# EAGLE schematic rpglb_badge (EAGLE 9.5.2)

## Sheet 1 of 2
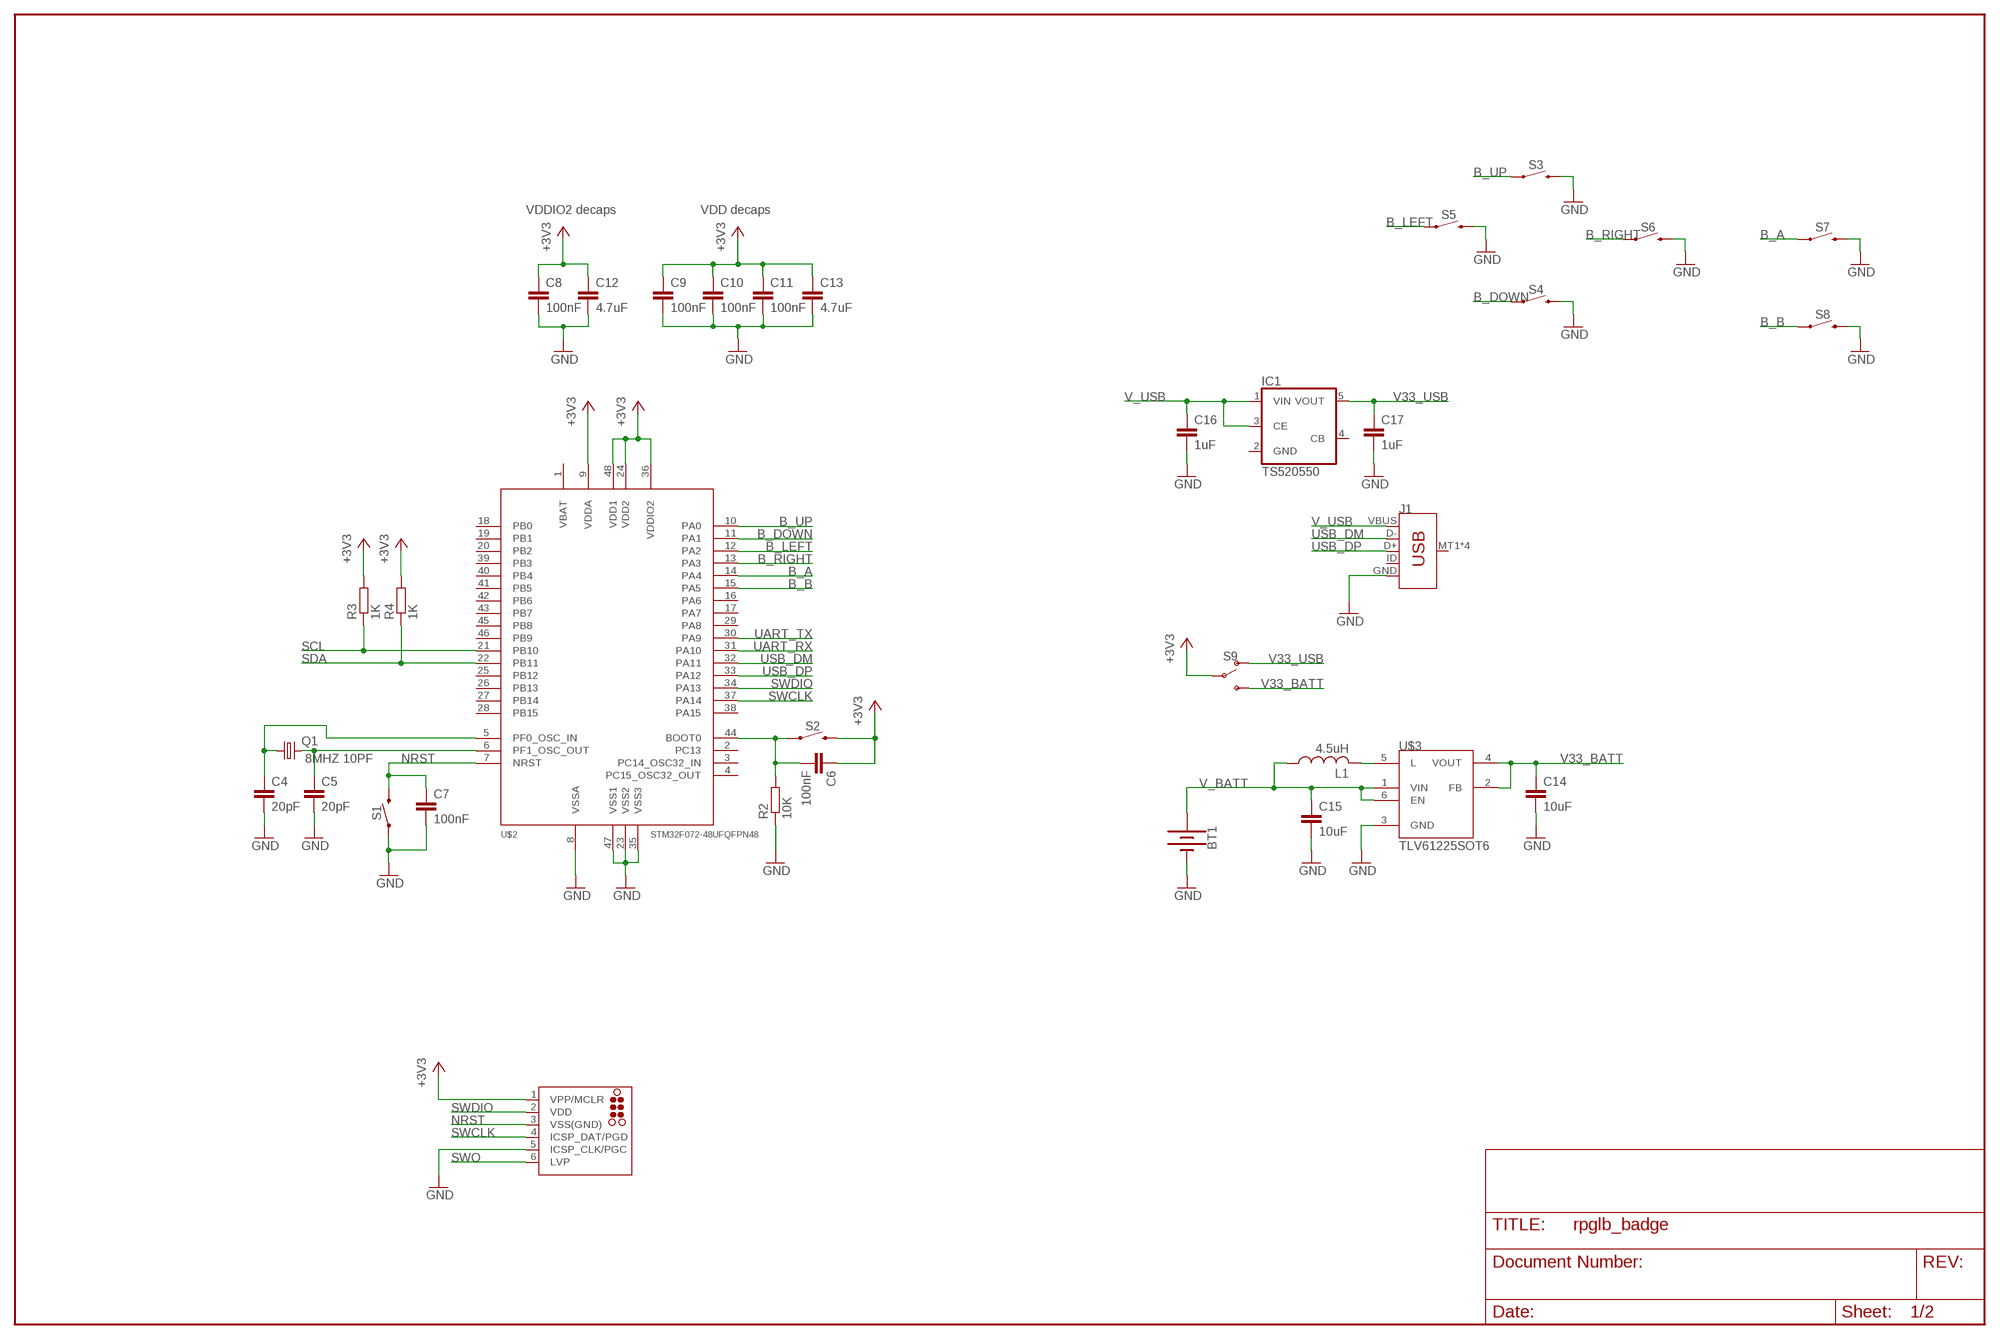
[diagram p0: schematic, sheet 1]

### Parts
BT1  BATTERY-AA  [BATTERY-AA]
C4  20pF  C-EUC0603  [C0603]
C5  20pF  C-EUC0603  [C0603]
C6  100nF  C-EUC0603  [C0603]
C7  100nF  C-EUC0603  [C0603]
C8  100nF  C-EUC0603  [C0603]
C9  100nF  C-EUC0603  [C0603]
C10  100nF  C-EUC0603  [C0603]
C11  100nF  C-EUC0603  [C0603]
C12  4.7uF  C-EUC0603  [C0603]
C13  4.7uF  C-EUC0603  [C0603]
C14  10uF  C-EUC0603  [C0603]
C15  10uF  C-EUC0603  [C0603]
C16  1uF  C-EUC0603  [C0603]
C17  1uF  C-EUC0603  [C0603]
IC1  TS520550  [SOT25]
J1  USB_MICRO-B_SMT  [USB-MICROB]
J3  TC2030  [TC2030-MCP-NL-CP]
L1  4.5uH  L-USPIS2816  [PIS2816]
Q1  8MHZ 10PF  CRYSTALCTS406  [CTS406]
R2  10K  R-EU_R0603  [R0603]
R3  1K  R-EU_R0603  [R0603]
R4  1K  R-EU_R0603  [R0603]
S1  MOMENTARY-SWITCH-SPST-SMD-5.2MM  [TACTILE_SWITCH_SMD_5.2MM]
S2  MOMENTARY-SWITCH-SPST-SMD-5.2MM  [TACTILE_SWITCH_SMD_5.2MM]
S3  MOMENTARY-SWITCH-SPST-SMD-5.2MM  [TACTILE_SWITCH_SMD_5.2MM]
S4  MOMENTARY-SWITCH-SPST-SMD-5.2MM  [TACTILE_SWITCH_SMD_5.2MM]
S5  MOMENTARY-SWITCH-SPST-SMD-5.2MM  [TACTILE_SWITCH_SMD_5.2MM]
S6  MOMENTARY-SWITCH-SPST-SMD-5.2MM  [TACTILE_SWITCH_SMD_5.2MM]
S7  MOMENTARY-SWITCH-SPST-SMD-5.2MM  [TACTILE_SWITCH_SMD_5.2MM]
S8  MOMENTARY-SWITCH-SPST-SMD-5.2MM  [TACTILE_SWITCH_SMD_5.2MM]
S9  SWITCH-SPDT-SMD-RIGHT-ANGLE  [SWITCH_SPST_SMD_A]
U$2  STM32F072-48UFQFPN48  [QFN50P700X700X60-49T560N]
U$3  TLV61225SOT6  [SOT65P210X110-6N]

### Nets
+3V3: C6.1 C8.1 C9.1 C10.1 C11.1 C12.1 C13.1 J3.1(VPP/MCLR) R3.2 R4.2 S2.3 S9.2(P) U$2.9(VDDA) U$2.24(VDD2) U$2.36(VDDIO2) U$2.48(VDD1) ; also sheet 2
B_A: S7.1 U$2.14(PA4)
B_B: S8.1 U$2.15(PA5)
B_DOWN: S4.1 U$2.11(PA1)
B_LEFT: S5.1 U$2.12(PA2)
B_RIGHT: S6.1 U$2.13(PA3)
B_UP: S3.1 U$2.10(PA0)
GND: BT1.GND@1(-) C4.2 C5.2 C7.2 C8.2 C9.2 C10.2 C11.2 C12.2 C13.2 C14.2 C15.2 C16.2 C17.2 J1.GND J3.5(ICSP_CLK/PGC) R2.1 S1.1 S3.3 S4.3 S5.3 S6.3 S7.3 S8.3 U$2.8(VSSA) U$2.23(VSS2) U$2.35(VSS3) U$2.47(VSS1) U$3.3(GND) ; also sheet 2
N$3: C5.1 Q1.3 U$2.6(PF1_OSC_OUT)
N$4: C4.1 Q1.1 U$2.5(PF0_OSC_IN)
N$5: C6.2 R2.2 S2.1 U$2.44(BOOT0)
N$6: L1.2 U$3.5(L)
NRST: C7.1 J3.3(VSS(GND)) S1.3 U$2.7(NRST)
SCL: R3.1 U$2.21(PB10)
SDA: R4.1 U$2.22(PB11) ; also sheet 2
SWCLK: J3.4(ICSP_DAT/PGD) U$2.37(PA14)
SWDIO: J3.2(VDD) U$2.34(PA13)
SWO: J3.6(LVP)
UART_RX: U$2.31(PA10)
UART_TX: U$2.30(PA9)
USB_DM: J1.D- U$2.32(PA11)
USB_DP: J1.D+ U$2.33(PA12)
V33_BATT: C14.1 S9.3(S) U$3.2(FB) U$3.4(VOUT)
V33_USB: C17.1 IC1.5(VOUT) S9.1(O)
V_BATT: BT1.PWR@1(+) C15.1 L1.1 U$3.1(VIN) U$3.6(EN)
V_USB: C16.1 IC1.1(VIN) IC1.3(CE) J1.VBUS
Unconnected: IC1.2(GND) IC1.4(CB) J1.ID J1.MT1(SHIELD) J1.MT2(SHIELD) J1.P$1(SHIELD) J1.P$2(SHIELD) U$2.1(VBAT) U$2.2(PC13) U$2.3(PC14_OSC32_IN) U$2.4(PC15_OSC32_OUT) U$2.16(PA6) U$2.17(PA7) U$2.18(PB0) U$2.19(PB1) U$2.20(PB2) U$2.25(PB12) U$2.26(PB13) U$2.27(PB14) U$2.28(PB15) U$2.29(PA8) U$2.38(PA15) U$2.39(PB3) U$2.40(PB4) U$2.41(PB5) U$2.42(PB6) U$2.43(PB7) U$2.45(PB8) U$2.46(PB9)

### Notes on the sheet
- VDDIO2 decaps | VDD decaps

## Sheet 2 of 2
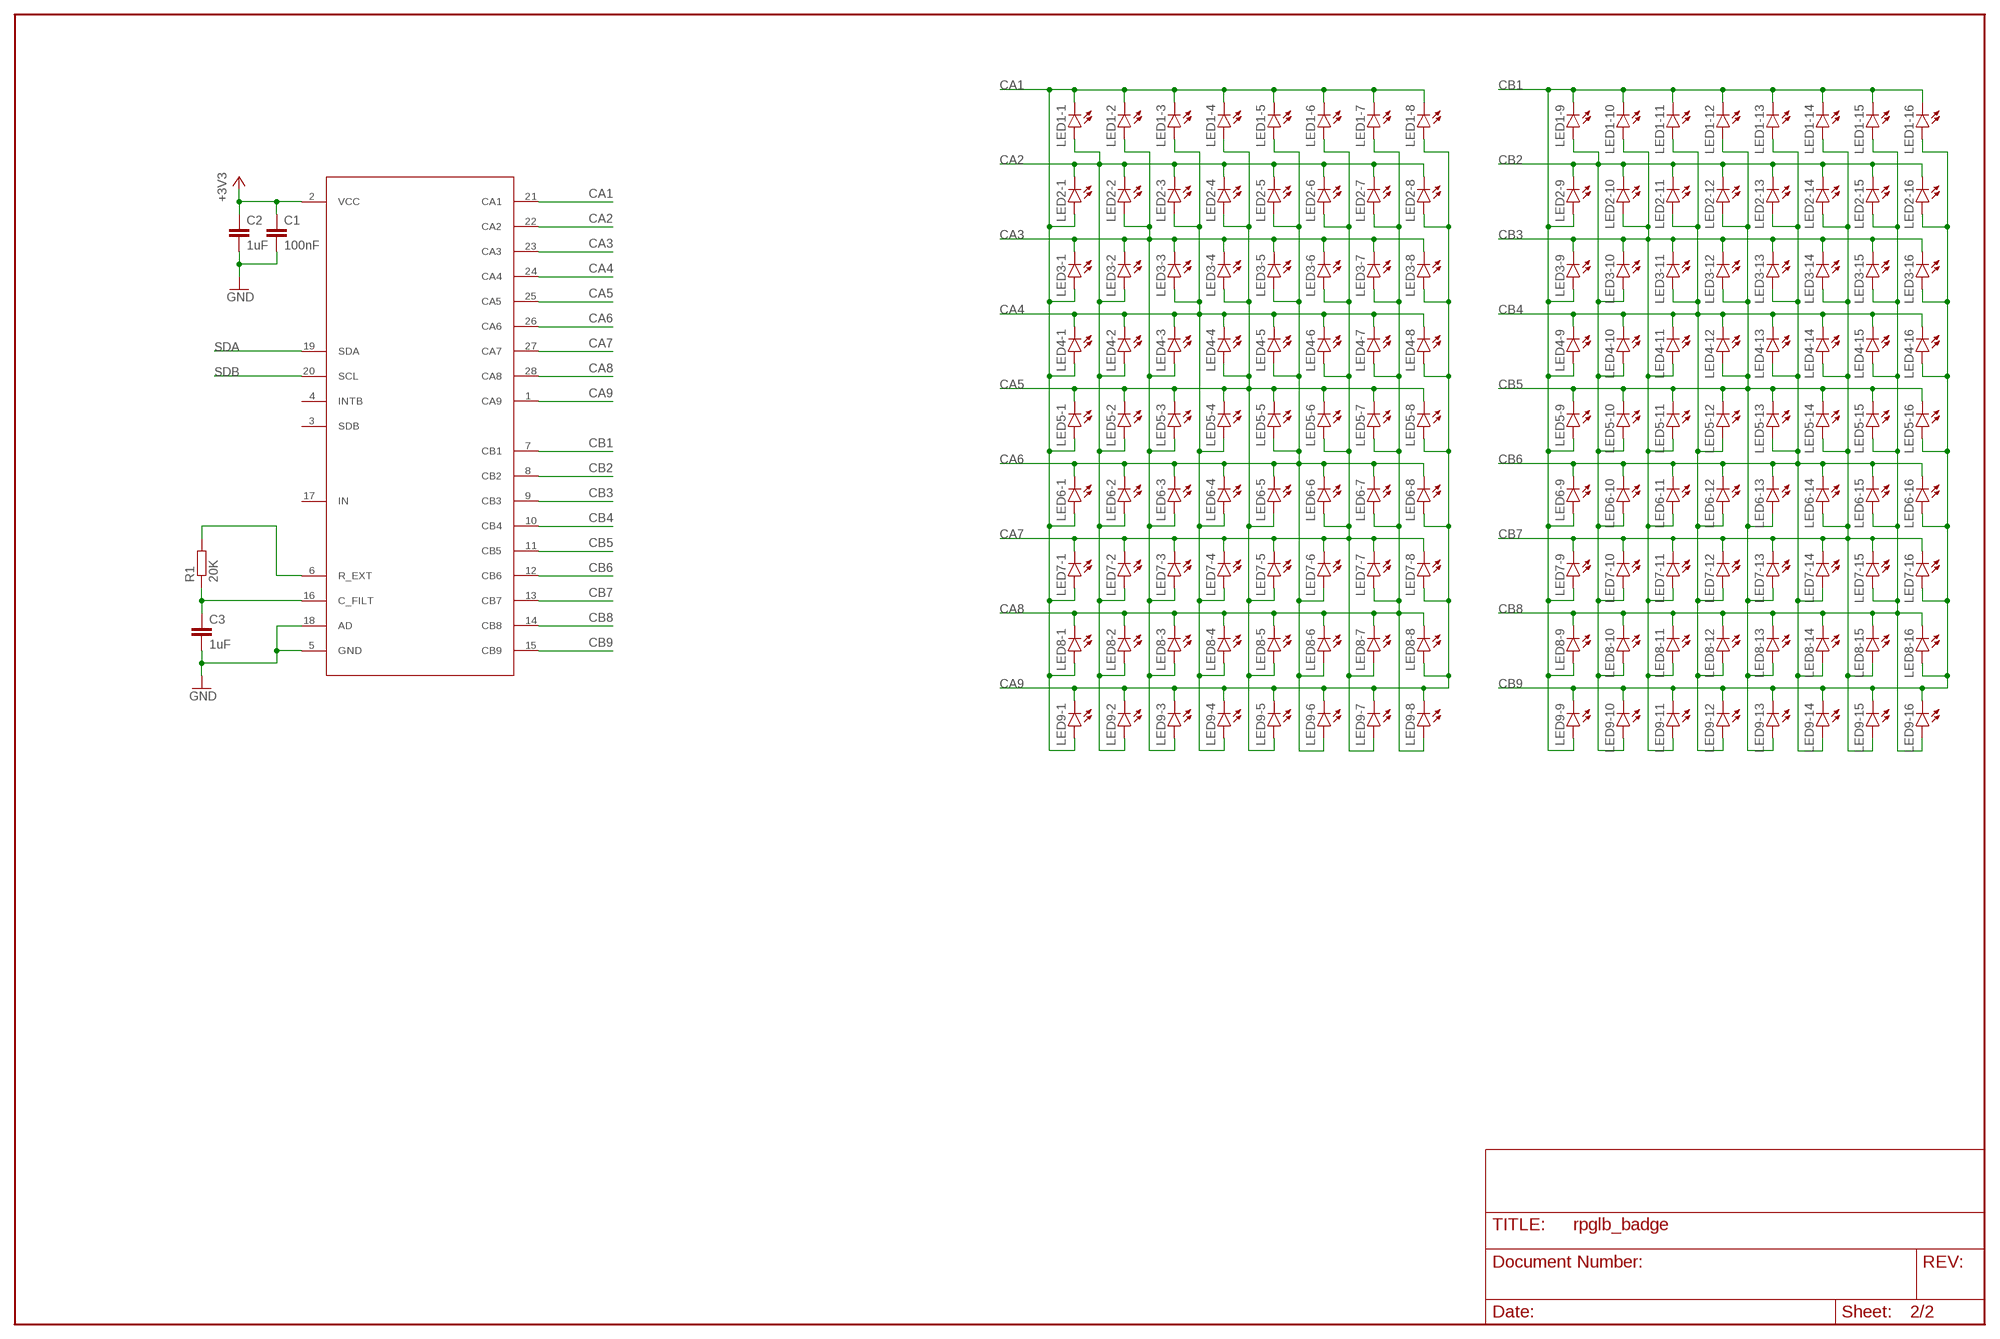
[diagram p1: schematic, sheet 2]

### Parts
C1  100nF  C-EUC0603  [C0603]
C2  1uF  C-EUC0603  [C0603]
C3  1uF  C-EUC0603  [C0603]
LED1-1  LEDCHIP-LED0603  [CHIP-LED0603]
LED1-2  LEDCHIP-LED0603  [CHIP-LED0603]
LED1-3  LEDCHIP-LED0603  [CHIP-LED0603]
LED1-4  LEDCHIP-LED0603  [CHIP-LED0603]
LED1-5  LEDCHIP-LED0603  [CHIP-LED0603]
LED1-6  LEDCHIP-LED0603  [CHIP-LED0603]
LED1-7  LEDCHIP-LED0603  [CHIP-LED0603]
LED1-8  LEDCHIP-LED0603  [CHIP-LED0603]
LED1-9  LEDCHIP-LED0603  [CHIP-LED0603]
LED1-10  LEDCHIP-LED0603  [CHIP-LED0603]
LED1-11  LEDCHIP-LED0603  [CHIP-LED0603]
LED1-12  LEDCHIP-LED0603  [CHIP-LED0603]
LED1-13  LEDCHIP-LED0603  [CHIP-LED0603]
LED1-14  LEDCHIP-LED0603  [CHIP-LED0603]
LED1-15  LEDCHIP-LED0603  [CHIP-LED0603]
LED1-16  LEDCHIP-LED0603  [CHIP-LED0603]
LED2-1  LEDCHIP-LED0603  [CHIP-LED0603]
LED2-2  LEDCHIP-LED0603  [CHIP-LED0603]
LED2-3  LEDCHIP-LED0603  [CHIP-LED0603]
LED2-4  LEDCHIP-LED0603  [CHIP-LED0603]
LED2-5  LEDCHIP-LED0603  [CHIP-LED0603]
LED2-6  LEDCHIP-LED0603  [CHIP-LED0603]
LED2-7  LEDCHIP-LED0603  [CHIP-LED0603]
LED2-8  LEDCHIP-LED0603  [CHIP-LED0603]
LED2-9  LEDCHIP-LED0603  [CHIP-LED0603]
LED2-10  LEDCHIP-LED0603  [CHIP-LED0603]
LED2-11  LEDCHIP-LED0603  [CHIP-LED0603]
LED2-12  LEDCHIP-LED0603  [CHIP-LED0603]
LED2-13  LEDCHIP-LED0603  [CHIP-LED0603]
LED2-14  LEDCHIP-LED0603  [CHIP-LED0603]
LED2-15  LEDCHIP-LED0603  [CHIP-LED0603]
LED2-16  LEDCHIP-LED0603  [CHIP-LED0603]
LED3-1  LEDCHIP-LED0603  [CHIP-LED0603]
LED3-2  LEDCHIP-LED0603  [CHIP-LED0603]
LED3-3  LEDCHIP-LED0603  [CHIP-LED0603]
LED3-4  LEDCHIP-LED0603  [CHIP-LED0603]
LED3-5  LEDCHIP-LED0603  [CHIP-LED0603]
LED3-6  LEDCHIP-LED0603  [CHIP-LED0603]
LED3-7  LEDCHIP-LED0603  [CHIP-LED0603]
LED3-8  LEDCHIP-LED0603  [CHIP-LED0603]
LED3-9  LEDCHIP-LED0603  [CHIP-LED0603]
LED3-10  LEDCHIP-LED0603  [CHIP-LED0603]
LED3-11  LEDCHIP-LED0603  [CHIP-LED0603]
LED3-12  LEDCHIP-LED0603  [CHIP-LED0603]
LED3-13  LEDCHIP-LED0603  [CHIP-LED0603]
LED3-14  LEDCHIP-LED0603  [CHIP-LED0603]
LED3-15  LEDCHIP-LED0603  [CHIP-LED0603]
LED3-16  LEDCHIP-LED0603  [CHIP-LED0603]
LED4-1  LEDCHIP-LED0603  [CHIP-LED0603]
LED4-2  LEDCHIP-LED0603  [CHIP-LED0603]
LED4-3  LEDCHIP-LED0603  [CHIP-LED0603]
LED4-4  LEDCHIP-LED0603  [CHIP-LED0603]
LED4-5  LEDCHIP-LED0603  [CHIP-LED0603]
LED4-6  LEDCHIP-LED0603  [CHIP-LED0603]
LED4-7  LEDCHIP-LED0603  [CHIP-LED0603]
LED4-8  LEDCHIP-LED0603  [CHIP-LED0603]
LED4-9  LEDCHIP-LED0603  [CHIP-LED0603]
LED4-10  LEDCHIP-LED0603  [CHIP-LED0603]
LED4-11  LEDCHIP-LED0603  [CHIP-LED0603]
LED4-12  LEDCHIP-LED0603  [CHIP-LED0603]
LED4-13  LEDCHIP-LED0603  [CHIP-LED0603]
LED4-14  LEDCHIP-LED0603  [CHIP-LED0603]
LED4-15  LEDCHIP-LED0603  [CHIP-LED0603]
LED4-16  LEDCHIP-LED0603  [CHIP-LED0603]
LED5-1  LEDCHIP-LED0603  [CHIP-LED0603]
LED5-2  LEDCHIP-LED0603  [CHIP-LED0603]
LED5-3  LEDCHIP-LED0603  [CHIP-LED0603]
LED5-4  LEDCHIP-LED0603  [CHIP-LED0603]
LED5-5  LEDCHIP-LED0603  [CHIP-LED0603]
LED5-6  LEDCHIP-LED0603  [CHIP-LED0603]
LED5-7  LEDCHIP-LED0603  [CHIP-LED0603]
LED5-8  LEDCHIP-LED0603  [CHIP-LED0603]
LED5-9  LEDCHIP-LED0603  [CHIP-LED0603]
LED5-10  LEDCHIP-LED0603  [CHIP-LED0603]
LED5-11  LEDCHIP-LED0603  [CHIP-LED0603]
LED5-12  LEDCHIP-LED0603  [CHIP-LED0603]
LED5-13  LEDCHIP-LED0603  [CHIP-LED0603]
LED5-14  LEDCHIP-LED0603  [CHIP-LED0603]
LED5-15  LEDCHIP-LED0603  [CHIP-LED0603]
LED5-16  LEDCHIP-LED0603  [CHIP-LED0603]
LED6-1  LEDCHIP-LED0603  [CHIP-LED0603]
LED6-2  LEDCHIP-LED0603  [CHIP-LED0603]
LED6-3  LEDCHIP-LED0603  [CHIP-LED0603]
LED6-4  LEDCHIP-LED0603  [CHIP-LED0603]
LED6-5  LEDCHIP-LED0603  [CHIP-LED0603]
LED6-6  LEDCHIP-LED0603  [CHIP-LED0603]
LED6-7  LEDCHIP-LED0603  [CHIP-LED0603]
LED6-8  LEDCHIP-LED0603  [CHIP-LED0603]
LED6-9  LEDCHIP-LED0603  [CHIP-LED0603]
LED6-10  LEDCHIP-LED0603  [CHIP-LED0603]
LED6-11  LEDCHIP-LED0603  [CHIP-LED0603]
LED6-12  LEDCHIP-LED0603  [CHIP-LED0603]
LED6-13  LEDCHIP-LED0603  [CHIP-LED0603]
LED6-14  LEDCHIP-LED0603  [CHIP-LED0603]
LED6-15  LEDCHIP-LED0603  [CHIP-LED0603]
LED6-16  LEDCHIP-LED0603  [CHIP-LED0603]
LED7-1  LEDCHIP-LED0603  [CHIP-LED0603]
LED7-2  LEDCHIP-LED0603  [CHIP-LED0603]
LED7-3  LEDCHIP-LED0603  [CHIP-LED0603]
LED7-4  LEDCHIP-LED0603  [CHIP-LED0603]
LED7-5  LEDCHIP-LED0603  [CHIP-LED0603]
LED7-6  LEDCHIP-LED0603  [CHIP-LED0603]
LED7-7  LEDCHIP-LED0603  [CHIP-LED0603]
LED7-8  LEDCHIP-LED0603  [CHIP-LED0603]
LED7-9  LEDCHIP-LED0603  [CHIP-LED0603]
LED7-10  LEDCHIP-LED0603  [CHIP-LED0603]
LED7-11  LEDCHIP-LED0603  [CHIP-LED0603]
LED7-12  LEDCHIP-LED0603  [CHIP-LED0603]
LED7-13  LEDCHIP-LED0603  [CHIP-LED0603]
LED7-14  LEDCHIP-LED0603  [CHIP-LED0603]
LED7-15  LEDCHIP-LED0603  [CHIP-LED0603]
LED7-16  LEDCHIP-LED0603  [CHIP-LED0603]
LED8-1  LEDCHIP-LED0603  [CHIP-LED0603]
LED8-2  LEDCHIP-LED0603  [CHIP-LED0603]
LED8-3  LEDCHIP-LED0603  [CHIP-LED0603]
LED8-4  LEDCHIP-LED0603  [CHIP-LED0603]
LED8-5  LEDCHIP-LED0603  [CHIP-LED0603]
LED8-6  LEDCHIP-LED0603  [CHIP-LED0603]
LED8-7  LEDCHIP-LED0603  [CHIP-LED0603]
LED8-8  LEDCHIP-LED0603  [CHIP-LED0603]
LED8-9  LEDCHIP-LED0603  [CHIP-LED0603]
LED8-10  LEDCHIP-LED0603  [CHIP-LED0603]
LED8-11  LEDCHIP-LED0603  [CHIP-LED0603]
LED8-12  LEDCHIP-LED0603  [CHIP-LED0603]
LED8-13  LEDCHIP-LED0603  [CHIP-LED0603]
LED8-14  LEDCHIP-LED0603  [CHIP-LED0603]
LED8-15  LEDCHIP-LED0603  [CHIP-LED0603]
LED8-16  LEDCHIP-LED0603  [CHIP-LED0603]
LED9-1  LEDCHIP-LED0603  [CHIP-LED0603]
LED9-2  LEDCHIP-LED0603  [CHIP-LED0603]
LED9-3  LEDCHIP-LED0603  [CHIP-LED0603]
LED9-4  LEDCHIP-LED0603  [CHIP-LED0603]
LED9-5  LEDCHIP-LED0603  [CHIP-LED0603]
LED9-6  LEDCHIP-LED0603  [CHIP-LED0603]
LED9-7  LEDCHIP-LED0603  [CHIP-LED0603]
LED9-8  LEDCHIP-LED0603  [CHIP-LED0603]
LED9-9  LEDCHIP-LED0603  [CHIP-LED0603]
LED9-10  LEDCHIP-LED0603  [CHIP-LED0603]
LED9-11  LEDCHIP-LED0603  [CHIP-LED0603]
LED9-12  LEDCHIP-LED0603  [CHIP-LED0603]
LED9-13  LEDCHIP-LED0603  [CHIP-LED0603]
LED9-14  LEDCHIP-LED0603  [CHIP-LED0603]
LED9-15  LEDCHIP-LED0603  [CHIP-LED0603]
LED9-16  LEDCHIP-LED0603  [CHIP-LED0603]
R1  20K  R-EU_R0603  [R0603]
U$1  IS31FL3731  [QFN40P400X400X80-29T230N]

### Nets
+3V3: C1.1 C2.1 U$1.2(VCC) ; also sheet 1
CA1: LED1-1.C LED1-2.C LED1-3.C LED1-4.C LED1-5.C LED1-6.C LED1-7.C LED1-8.C LED2-1.A LED3-1.A LED4-1.A LED5-1.A LED6-1.A LED7-1.A LED8-1.A LED9-1.A U$1.21(CA1)
CA2: LED1-1.A LED2-1.C LED2-2.C LED2-3.C LED2-4.C LED2-5.C LED2-6.C LED2-7.C LED2-8.C LED3-2.A LED4-2.A LED5-2.A LED6-2.A LED7-2.A LED8-2.A LED9-2.A U$1.22(CA2)
CA3: LED1-2.A LED2-2.A LED3-1.C LED3-2.C LED3-3.C LED3-4.C LED3-5.C LED3-6.C LED3-7.C LED3-8.C LED4-3.A LED5-3.A LED6-3.A LED7-3.A LED8-3.A LED9-3.A U$1.23(CA3)
CA4: LED1-3.A LED2-3.A LED3-3.A LED4-1.C LED4-2.C LED4-3.C LED4-4.C LED4-5.C LED4-6.C LED4-7.C LED4-8.C LED5-4.A LED6-4.A LED7-4.A LED8-4.A LED9-4.A U$1.24(CA4)
CA5: LED1-4.A LED2-4.A LED3-4.A LED4-4.A LED5-1.C LED5-2.C LED5-3.C LED5-4.C LED5-5.C LED5-6.C LED5-7.C LED5-8.C LED6-5.A LED7-5.A LED8-5.A LED9-5.A U$1.25(CA5)
CA6: LED1-5.A LED2-5.A LED3-5.A LED4-5.A LED5-5.A LED6-1.C LED6-2.C LED6-3.C LED6-4.C LED6-5.C LED6-6.C LED6-7.C LED6-8.C LED7-6.A LED8-6.A LED9-6.A U$1.26(CA6)
CA7: LED1-6.A LED2-6.A LED3-6.A LED4-6.A LED5-6.A LED6-6.A LED7-1.C LED7-2.C LED7-3.C LED7-4.C LED7-5.C LED7-6.C LED7-7.C LED7-8.C LED8-7.A LED9-7.A U$1.27(CA7)
CA8: LED1-7.A LED2-7.A LED3-7.A LED4-7.A LED5-7.A LED6-7.A LED7-7.A LED8-1.C LED8-2.C LED8-3.C LED8-4.C LED8-5.C LED8-6.C LED8-7.C LED8-8.C LED9-8.A U$1.28(CA8)
CA9: LED1-8.A LED2-8.A LED3-8.A LED4-8.A LED5-8.A LED6-8.A LED7-8.A LED8-8.A LED9-1.C LED9-2.C LED9-3.C LED9-4.C LED9-5.C LED9-6.C LED9-7.C LED9-8.C U$1.1(CA9)
CB1: LED1-9.C LED1-10.C LED1-11.C LED1-12.C LED1-13.C LED1-14.C LED1-15.C LED1-16.C LED2-9.A LED3-9.A LED4-9.A LED5-9.A LED6-9.A LED7-9.A LED8-9.A LED9-9.A U$1.7(CB1)
CB2: LED1-9.A LED2-9.C LED2-10.C LED2-11.C LED2-12.C LED2-13.C LED2-14.C LED2-15.C LED2-16.C LED3-10.A LED4-10.A LED5-10.A LED6-10.A LED7-10.A LED8-10.A LED9-10.A U$1.8(CB2)
CB3: LED1-10.A LED2-10.A LED3-9.C LED3-10.C LED3-11.C LED3-12.C LED3-13.C LED3-14.C LED3-15.C LED3-16.C LED4-11.A LED5-11.A LED6-11.A LED7-11.A LED8-11.A LED9-11.A U$1.9(CB3)
CB4: LED1-11.A LED2-11.A LED3-11.A LED4-9.C LED4-10.C LED4-11.C LED4-12.C LED4-13.C LED4-14.C LED4-15.C LED4-16.C LED5-12.A LED6-12.A LED7-12.A LED8-12.A LED9-12.A U$1.10(CB4)
CB5: LED1-12.A LED2-12.A LED3-12.A LED4-12.A LED5-9.C LED5-10.C LED5-11.C LED5-12.C LED5-13.C LED5-14.C LED5-15.C LED5-16.C LED6-13.A LED7-13.A LED8-13.A LED9-13.A U$1.11(CB5)
CB6: LED1-13.A LED2-13.A LED3-13.A LED4-13.A LED5-13.A LED6-9.C LED6-10.C LED6-11.C LED6-12.C LED6-13.C LED6-14.C LED6-15.C LED6-16.C LED7-14.A LED8-14.A LED9-14.A U$1.12(CB6)
CB7: LED1-14.A LED2-14.A LED3-14.A LED4-14.A LED5-14.A LED6-14.A LED7-9.C LED7-10.C LED7-11.C LED7-12.C LED7-13.C LED7-14.C LED7-15.C LED7-16.C LED8-15.A LED9-15.A U$1.13(CB7)
CB8: LED1-15.A LED2-15.A LED3-15.A LED4-15.A LED5-15.A LED6-15.A LED7-15.A LED8-9.C LED8-10.C LED8-11.C LED8-12.C LED8-13.C LED8-14.C LED8-15.C LED8-16.C LED9-16.A U$1.14(CB8)
CB9: LED1-16.A LED2-16.A LED3-16.A LED4-16.A LED5-16.A LED6-16.A LED7-16.A LED8-16.A LED9-9.C LED9-10.C LED9-11.C LED9-12.C LED9-13.C LED9-14.C LED9-15.C LED9-16.C U$1.15(CB9)
GND: C1.2 C2.2 C3.2 U$1.5(GND) U$1.18(AD) ; also sheet 1
N$1: R1.2 U$1.6(R_EXT)
N$2: C3.1 R1.1 U$1.16(C_FILT)
SDA: U$1.19(SDA) ; also sheet 1
SDB: U$1.20(SCL)
Unconnected: U$1.3(SDB) U$1.4(INTB) U$1.17(IN)

## Library data of the parts
BT1 = SparkFun-Batteries:BATTERY: Battery - Single Cell A variety of battery chemistries, sizes, and footprints. Device List: 20MM_PTH - Coin Cell Battery Holder - 20mm (PTH) <https://www.sparkfun.com/products/783> 6.8MM_PTH - Coin Cell Battery Holder - 6.8MM(SMD) <https://www.digikey.com/product-detail/en/seiko-instruments/MS621FE-FL11E/728-1057-ND/1889208?WT.srch=1&gclid=CNOQ5a6LzdQCFZS2wAodXCkE0g> 12MM_SMD - Coin Cell Battery Holder - 12mm (SMD) <https://www.sparkfun.com/products/10592> 12MM_PTH - Coin Cell Battery Holder - 12mm (PTH) <https://www.sparkfun.com/products/7948> 20MM_SMD - 20mm Coin Cell Battery Holder (SMD) (2 legs) Used on the Big Time Watch Kit <https://www.sparkfun.com/products/11734> 20MM_SMD_4LEGS - Coin Cell Battery Holder - 20mm (SMD) <https://www.sparkfun.com/products/11892> 20MM_SMD_4LEGS_OVERPASTE - Coin Cell Battery Holder - 20mm (SMD) <https://www.sparkfun.com/products/11892> (Over-paste on the legs) 24.5MM_PTH - Coin Cell Battery Holder - 24.5mm (PTH) <https://www.sparkfun.com/products/8863> 9V - 9V Battery Holder - PC Mount Used on the SparkFun SparkPunk Sound Kit <https://www.sparkfun.com/products/11177> and SparkFun SparkPunk Sequencer Kit <https://www.sparkfun.com/products/12707> 18650 - Battery Holder - 18650 (PTH) <https://www.sparkfun.com/products/13113> AA - Battery Holder - 1xAA (PTH) <https://www.sparkfun.com/products/7949> AAA - Battery Holder - 1xAAA (PTH) <https://www.sparkfun.com/products/12718> AA_KIT - Battery Holder - 1xAA (PTH) <https://www.sparkfun.com/products/7949> Special kit package - pads only have exposed copper on one side of the board. AAA_KIT - Battery Holder - 1xAAA (PTH) <https://www.sparkfun.com/products/12718> Special kit package - pads only have exposed copper on one side of the board.; PROD_ID: BATT-08316; SF_SKU: PRT-07949
C1-C17 = rcl:C-EU: CAPACITOR, European symbol; SPICEPREFIX: C
IC1 = v-reg:TS5205: 150mA Low Noise LDO Voltage Regulator with Enable TSC [Taiwan Semiconductor Company, Ltd] Source: http://www.taiwansemi.com .. 5205_0409c.pdf
J1 = SparkFun-Connectors:USB_MICRO-B: USB Type Micro-B Connector Male/female and PTH/SMT variants SparkFun Products: SparkFun microB USB Breakout <https://www.sparkfun.com/products/12035> SparkFun USB microB Plug Breakout <https://www.sparkfun.com/products/10031> SparkFun ESP8266 Thing <https://www.sparkfun.com/products/13231>; PROD_ID: CONN-09505; SF_ID: PRT-08533
J3 = tag-connect:TC2030: TAG-CONNECT ICSP Connector Manufacturer: Tag-Connect <http://www.tag-connect.com> Cable for easy In-Circuit Serial Programming. Designed for Microchip ICD2, suitable for many others. Two variants - one "with legs" (for hands-free fit on PCB) and another "without legs" for quick programming. PAD Description 1 MCLR/Vpp 2 Vdd 3 GND 4 PGD (ISPDAT) 5 PGC (ISPCLK) 6 nc (used for LVP) ©2009 ROFA.cz - modified and updated by Robert Darlington ‹rdarlington@gmail.com›
L1 = rcl:L-US: INDUCTOR, American symbol; SPICEPREFIX: L
LED1-1-LED1-16 LED2-1-LED2-16 LED3-1-LED3-16 LED4-1-LED4-16 LED5-1-LED5-16 LED6-1-LED6-16 LED7-1-LED7-16 LED8-1-LED8-16 LED9-1-LED9-16 = led:LED: LED OSRAM: - CHIPLED LG R971, LG N971, LY N971, LG Q971, LY Q971, LO R971, LY R971 LH N974, LH R974 LS Q976, LO Q976, LY Q976 LO Q996 - Hyper CHIPLED LW Q18S LB Q993, LB Q99A, LB R99A - SideLED LS A670, LO A670, LY A670, LG A670, LP A670 LB A673, LV A673, LT A673, LW A673 LH A674 LY A675 LS A676, LA A676, LO A676, LY A676, LW A676 LS A679, LY A679, LG A679 - Hyper Micro SIDELED® LS Y876, LA Y876, LO Y876, LY Y876 LT Y87S - SmartLED LW L88C, LW L88S LB L89C, LB L89S, LG L890 LS L89K, LO L89K, LY L89K LS L896, LA L896, LO L896, LY L896 - TOPLED LS T670, LO T670, LY T670, LG T670, LP T670 LSG T670, LSP T670, LSY T670, LOP T670, LYG T670 LG T671, LOG T671, LSG T671 LB T673, LV T673, LT T673, LW T673 LH T674 LS T676, LA T676, LO T676, LY T676, LB T676, LH T676, LSB T676, LW T676 LB T67C, LV T67C, LT T67C, LS T67K, LO T67K, LY T67K, LW E67C LS E67B, LA E67B, LO E67B, LY E67B, LB E67C, LV E67C, LT E67C LW T67C LS T679, LY T679, LG T679 LS T770, LO T770, LY T770, LG T770, LP T770 LB T773, LV T773, LT T773, LW T773 LH T774 LS E675, LA E675, LY E675, LS T675 LS T776, LA T776, LO T776, LY T776, LB T776 LHGB T686 LT T68C, LB T68C - Hyper Mini TOPLED® LB M676 - Mini TOPLED Santana® LG M470 LS M47K, LO M47K, LY M47K Source: http://www.osram.convergy.de LUXEON: - LUMILED® LXK2-PW12-R00, LXK2-PW12-S00, LXK2-PW14-U00, LXK2-PW14-V00 LXK2-PM12-R00, LXK2-PM12-S00, LXK2-PM14-U00 LXK2-PE12-Q00, LXK2-PE12-R00, LXK2-PE12-S00, LXK2-PE14-T00, LXK2-PE14-U00 LXK2-PB12-K00, LXK2-PB12-L00, LXK2-PB12-M00, LXK2-PB14-N00, LXK2-PB14-P00, LXK2-PB14-Q00 LXK2-PR12-L00, LXK2-PR12-M00, LXK2-PR14-Q00, LXK2-PR14-R00 LXK2-PD12-Q00, LXK2-PD12-R00, LXK2-PD12-S00 LXK2-PH12-R00, LXK2-PH12-S00 LXK2-PL12-P00, LXK2-PL12-Q00, LXK2-PL12-R00 Source: www.luxeon.com KINGBRIGHT: KA-3528ASYC Source: www.kingbright.com
Q1 = crystal:CRYSTAL: CRYSTAL; OC_FARNELL: unknown; OC_NEWARK: unknown
R1-R4 = rcl:R-EU_: RESISTOR, European symbol; SPICEPREFIX: R
S1-S8 = SparkFun-Switches:MOMENTARY-SWITCH-SPST: Momentary Switch (Pushbutton) - SPST Normally-open (NO) SPST momentary switches (buttons, pushbuttons). Variants PTH-12MM - 12mm square, through-hole Momentary Pushbutton Switch - 12mm Square <https://www.sparkfun.com/products/9190> (COM-09190) PTH-6.0MM, PTH-6.0MM-KIT - 6.0mm square, through-hole Mini Pushbutton Switch <https://www.sparkfun.com/products/97> (COM-00097) KIT package intended for soldering kit's - only one side of pads' copper is exposed. PTH-RIGHT-ANGLE-KIT - Right-angle, through-hole Right Angle Tactile Button <https://www.sparkfun.com/products/10791> - Used on SparkFun BigTime Watch Kit <https://www.sparkfun.com/products/11734> SMD-12MM - 12mm square, surface-mount Tactile Button - SMD (12mm) <https://www.sparkfun.com/products/12993> (COM-12993) Used on SparkFun PicoBoard <https://www.sparkfun.com/products/11888> SMD-4.5MM - 4.5mm Square Trackball Switch Used on SparkFun Blackberry Trackballer Breakout <https://www.sparkfun.com/products/13169> SMD-4.6MMX2.8MM - 4.60mm x 2.80mm, surface mount Used on SparkFun SAMD21 Mini Breakout <https://www.sparkfun.com/products/13664> SMD-5.2MM, SMD-5.2-REDUNDANT - 5.2mm square, surface-mount Mini Pushbutton Switch - SMD <https://www.sparkfun.com/products/8720> (COM-08720) Used on Arduino Pro Mini <https://www.sparkfun.com/products/11114> REDUNDANT package connects both switch circuits together SMD-6.0X3.5MM - 6.0 x 3.5mm, surface mount Momentary Reset Switch SMD <https://www.sparkfun.com/products/8229> (COM-08229) SMD-6.2MM-TALL - 6.2mm square, surface mount Tactile Button - SMD (6mm) <https://www.sparkfun.com/products/12992> Used on SparkFun Digital Sandbox <https://www.sparkfun.com/products/12651> SMD-RIGHT-ANGLE - Right-angle, surface mount Used on SparkFun Block for Intel® Edison - Arduino <https://www.sparkfun.com/products/13036>; PROD_ID: SWCH-08247; SF_SKU: COM-08720
S9 = SparkFun-Switches:SWITCH-SPDT: Single Pole, Double Throw (SPDT) Switch Single-pole, double-throw (SPDT) switch. Variant Overview SMD-AYZ0202 Surface Mount DPDT Switch <https://www.sparkfun.com/products/597> (COM-00597) Used on e.g. LilyPad Arduino USB - ATmega32U4 Board <https://www.sparkfun.com/products/12049> PTH-11.6X4.0MM SPDT Mini Power Switch <https://www.sparkfun.com/products/102> (COM-00102) Used on e.g. SparkFun Simon Says - Through-Hole Soldering Kit <https://www.sparkfun.com/products/10547> (KIT-10547) PTH-11.6X4.0MM-KIT KIT version of SPDT Mini Power Switch - Simplifies soldering by removing tStop of switch pins - only one side can be soldered. PTH-11.6X4.0MM-LOCK LOCK version of SPDT Mini Power Switch - Offset pins hold switch in place for easier soldering. SMD-RIGHT-ANGLE Surface Mount Right Angle Switch <https://www.sparkfun.com/products/10860> (COM-10860) Used on e.g. SparkFun ESP8266 Thing <https://www.sparkfun.com/products/13231>; PROD_ID: SWCH-10651; SF_SKU: COM-10860
U$1 = konkers:IS31FL3731
U$2 = konkers:STM32F072-48
U$3 = konkers:TLV61225